# Altium schematic sheet U2S_XLAT.SchDoc
size A
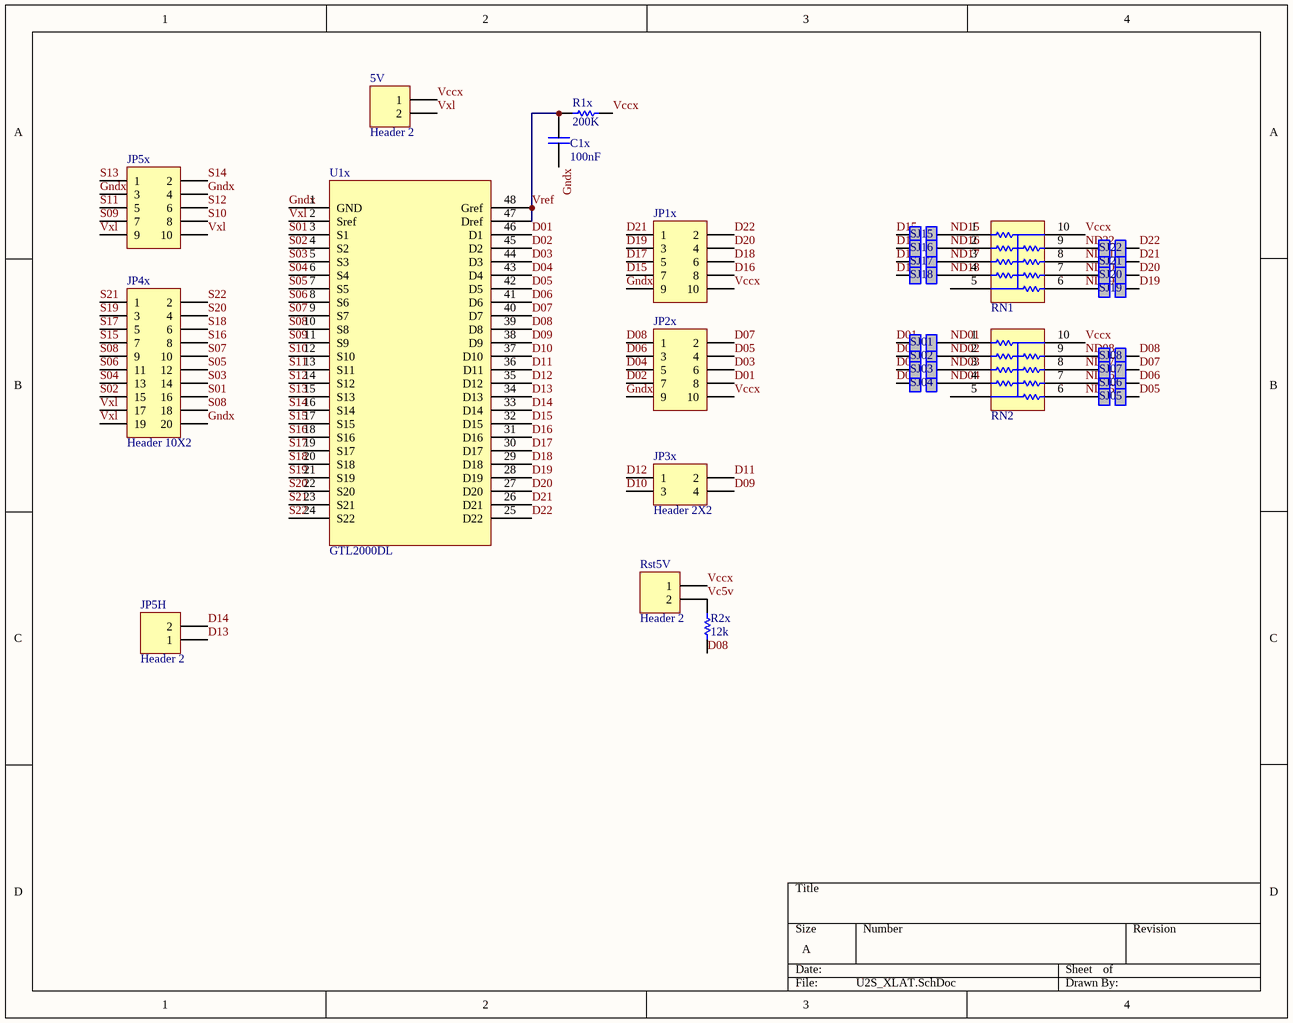
[diagram p0: U2S_XLAT.SchDoc]

## Parts
5V  Header 2  [HDR1X2]
C1x  value 100nF  [SMD0603]  (hidden comment: Capacitor)
JP1x  Header 5X2  [HDR2X5]  (value not drawn)
JP2x  Header 5X2  [HDR2X5]  (value not drawn)
JP3x  Header 2X2  [HDR2X2]
JP4x  Header 10X2  [HDR2X10]
JP5H  Header 2  [HDR1X2]
JP5x  Header 5X2  [HDR2X5]  (value not drawn)
R1x  value 200K  [SMD0805]  (hidden comment: Resistor)
R2x  value 12k  [SMD0603]  (hidden comment: Resistor)
RN1  YC158  [YC158]  (value not drawn)
RN2  YC158  [YC158]  (value not drawn)
Rst5V  Header 2  [HDR1X2]
SJ01  Jumper  [Jumper]  (value not drawn)
SJ02  Jumper  [Jumper]  (value not drawn)
SJ03  Jumper  [Jumper]  (value not drawn)
SJ04  Jumper  [Jumper]  (value not drawn)
SJ05  Jumper  [Jumper]  (value not drawn)
SJ06  Jumper  [Jumper]  (value not drawn)
SJ07  Jumper  [Jumper]  (value not drawn)
SJ08  Jumper  [Jumper]  (value not drawn)
SJ15  Jumper  [Jumper]  (value not drawn)
SJ16  Jumper  [Jumper]  (value not drawn)
SJ17  Jumper  [Jumper]  (value not drawn)
SJ18  Jumper  [Jumper]  (value not drawn)
SJ19  Jumper  [Jumper]  (value not drawn)
SJ20  Jumper  [Jumper]  (value not drawn)
SJ21  Jumper  [Jumper]  (value not drawn)
SJ22  Jumper  [Jumper]  (value not drawn)
U1x  GTL2000DL  [SSOP48]

## Nets
D01: JP2x.8 SJ01.2 U1x.46(D1)
D02: JP2x.7 SJ02.2 U1x.45(D2)
D03: JP2x.6 SJ03.2 U1x.44(D3)
D04: JP2x.5 SJ04.2 U1x.43(D4)
D05: JP2x.4 SJ05.2 U1x.42(D5)
D06: JP2x.3 SJ06.2 U1x.41(D6)
D07: JP2x.2 SJ07.2 U1x.40(D7)
D08: JP2x.1 R2x.1 SJ08.2 U1x.39(D8)
D09: JP3x.4 U1x.38(D9)
D10: JP3x.3 U1x.37(D10)
D11: JP3x.2 U1x.36(D11)
D12: JP3x.1 U1x.35(D12)
D13: JP5H.1 U1x.34(D13)
D14: JP5H.2 U1x.33(D14)
D15: JP1x.7 SJ15.2 U1x.32(D15)
D16: JP1x.8 SJ16.2 U1x.31(D16)
D17: JP1x.5 SJ17.2 U1x.30(D17)
D18: JP1x.6 SJ18.2 U1x.29(D18)
D19: JP1x.3 SJ19.2 U1x.28(D19)
D20: JP1x.4 SJ20.2 U1x.27(D20)
D21: JP1x.1 SJ21.2 U1x.26(D21)
D22: JP1x.2 SJ22.2 U1x.25(D22)
Gndx: C1x.1 JP1x.9 JP2x.9 JP4x.20 JP5x.3 JP5x.4 U1x.1(GND)
ND01: RN2.1 SJ01.1
ND02: RN2.2 SJ02.1
ND03: RN2.3 SJ03.1
ND04: RN2.4 SJ04.1
ND05: RN2.6 SJ05.1
ND06: RN2.7 SJ06.1
ND07: RN2.8 SJ07.1
ND08: RN2.9 SJ08.1
ND15: RN1.1 SJ15.1
ND16: RN1.2 SJ16.1
ND17: RN1.3 SJ17.1
ND18: RN1.4 SJ18.1
ND19: RN1.6 SJ19.1
ND20: RN1.7 SJ20.1
ND21: RN1.8 SJ21.1
ND22: RN1.9 SJ22.1
S01: JP4x.16 U1x.3(S1)
S02: JP4x.15 U1x.4(S2)
S03: JP4x.14 U1x.5(S3)
S04: JP4x.13 U1x.6(S4)
S05: JP4x.12 U1x.7(S5)
S06: JP4x.11 U1x.8(S6)
S07: JP4x.10 U1x.9(S7)
S08: JP4x.9 JP4x.18 U1x.10(S8)
S09: JP5x.7 U1x.11(S9)
S10: JP5x.8 U1x.12(S10)
S11: JP5x.5 U1x.13(S11)
S12: JP5x.6 U1x.14(S12)
S13: JP5x.1 U1x.15(S13)
S14: JP5x.2 U1x.16(S14)
S15: JP4x.7 U1x.17(S15)
S16: JP4x.8 U1x.18(S16)
S17: JP4x.5 U1x.19(S17)
S18: JP4x.6 U1x.20(S18)
S19: JP4x.3 U1x.21(S19)
S20: JP4x.4 U1x.22(S20)
S21: JP4x.1 U1x.23(S21)
S22: JP4x.2 U1x.24(S22)
Vc5v: R2x.2 Rst5V.2
Vccx: 5V.1 JP1x.10 JP2x.10 R1x.2 RN1.10 RN2.10 Rst5V.1
Vref: C1x.2 R1x.1 U1x.47(Dref) U1x.48(Gref)
Vxl: 5V.2 JP4x.17 JP4x.19 JP5x.9 JP5x.10 U1x.2(Sref)

Not connected (* = marked no-connect by the designer): RN1 5; RN2 5

## Library data of the parts
5V JP5H Rst5V = Header 2: Header, 2-Pin; Revision: 17-Jul-2002: Re-released for DXP Platform.; Publisher: Altium Limited
JP1x JP2x JP5x = Header 5X2: Header, 5-Pin, Dual row; Revision: 17-Jul-2002: Re-released for DXP Platform.; Publisher: Altium Limited
JP3x = Header 2X2: Header, 2-Pin, Dual row; Revision: 17-Jul-2002: Re-released for DXP Platform.; Publisher: Altium Limited
JP4x = Header 10X2: Header, 10-Pin, Dual row; Revision: 17-Jul-2002: Re-released for DXP Platform.; Publisher: Altium Limited
SJ01 SJ02 SJ03 SJ04 SJ05 SJ06 SJ07 SJ08 SJ15-SJ22 = Jumper: Solder Jumper